# Altium schematic sheet MCU.SchDoc
size A4; Organization: Altium Limited; Address1: L3, 12a Rodborough Rd; Address2: Frenchs Forest; Address3: NSW; Address4: Australia 2086
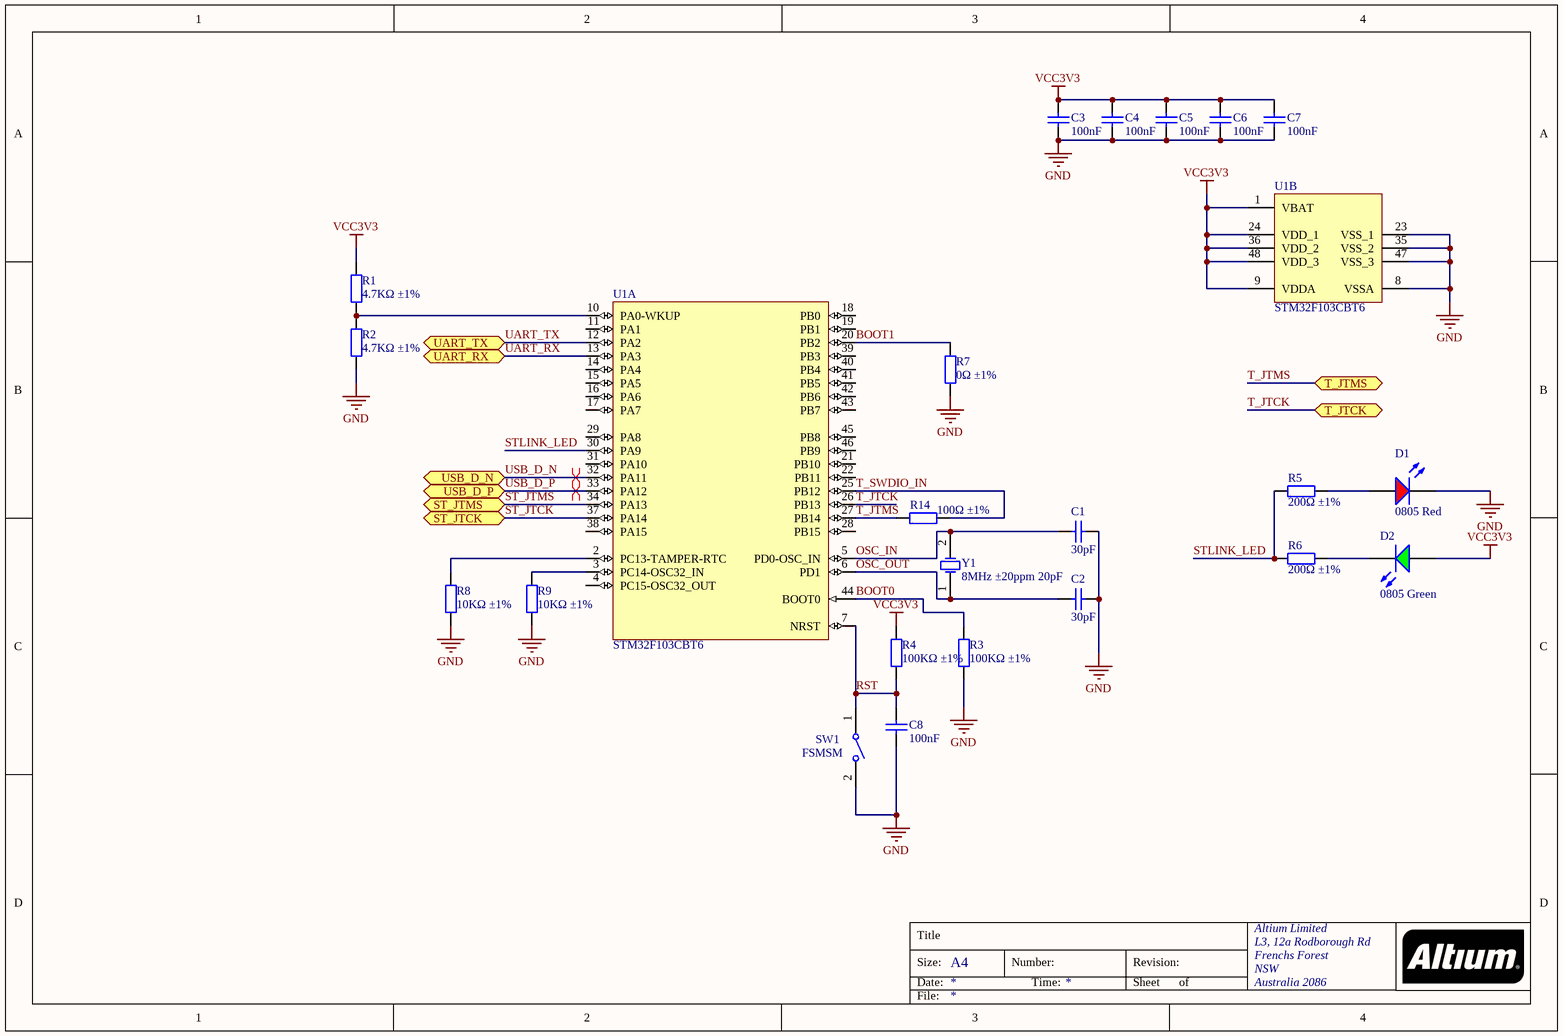
[diagram p0: MCU.SchDoc]

## Parts
C1  30pF  [0402_C]
C2  30pF  [0402_C]
C3  100nF  [0402_C]
C4  100nF  [0402_C]
C5  100nF  [0402_C]
C6  100nF  [0402_C]
C7  100nF  [0402_C]
C8  100nF  [0402_C]
D1  0805 Red  [0805_LED_S1]
D2  0805 Green  [0805_LED_S1]
R1  4.7KΩ ±1%  [0805_R]
R2  4.7KΩ ±1%  [0805_R]
R3  100KΩ ±1%  [0402_R]
R4  100KΩ ±1%  [0402_R]
R5  200Ω ±1%  [0402_R]
R6  200Ω ±1%  [0402_R]
R7  0Ω ±1%  [0402_R]
R8  10KΩ ±1%  [0402_R]
R9  10KΩ ±1%  [0402_R]
R14  100Ω ±1%  [0402_R]
SW1  FSMSM  [TECO-FSMSM-2_V]
U1  STM32F103CBT6  [LQFP-48_7x7x05P]  (parts A,B of 2)
Y1  8MHz ±20ppm 20pF  [SMD-5032_2P]

## Ports
ST_JTCK (bidir), ST_JTMS (bidir), T_JTCK (bidir), T_JTMS (bidir), UART_RX (bidir), UART_TX (bidir), USB_D_N (bidir), USB_D_P (bidir)

## Nets
GND: C1.2 C2.2 C3.1 C4.1 C5.1 C6.1 C7.1 C8.1 D1.K R2.1 R3.1 R7.1 R8.1 R9.1 SW1.2 U1.8(VSSA) U1.23(VSS_1) U1.35(VSS_2) U1.47(VSS_3)
VCC3V3: C3.2 C4.2 C5.2 C6.2 C7.2 D2.A R1.2 R4.2 U1.1(VBAT) U1.9(VDDA) U1.24(VDD_1) U1.36(VDD_2) U1.48(VDD_3)
BOOT0: R3.2 U1.44(BOOT0)
BOOT1: R7.2 U1.20(PB2)
OSC_IN: C1.1 U1.5(PD0-OSC_IN) Y1.2(OSC2)
OSC_OUT: C2.1 U1.6(PD1) Y1.1(OSC1)
RST: C8.2 R4.1 SW1.1 U1.7(NRST)
ST_JTCK: U1.37(PA14) ; port ST_JTCK
ST_JTMS: U1.34(PA13) ; port ST_JTMS
STLINK_LED: R5.1 R6.1 U1.30(PA9)
T_JTCK: U1.26(PB13) ; port T_JTCK
T_JTMS: R14.2 U1.27(PB14) ; port T_JTMS
T_SWDIO_IN: R14.1 U1.25(PB12)
UART_RX: U1.13(PA3) ; port UART_RX
UART_TX: U1.12(PA2) ; port UART_TX
USB_D_N: U1.32(PA11) ; port USB_D_N
USB_D_P: U1.33(PA12) ; port USB_D_P
NetD1_A: D1.A R5.2
NetD2_K: D2.K R6.2
NetR1_1: R1.1 R2.2 U1.10(PA0-WKUP)
NetR8_2: R8.2 U1.2(PC13-TAMPER-RTC)
NetR9_2: R9.2 U1.3(PC14-OSC32_IN)

Not connected (* = marked no-connect by the designer): U1 4(PC15-OSC32_OUT) 11(PA1) 14(PA4) 15(PA5) 16(PA6) 17(PA7) 18(PB0) 19(PB1) 21(PB10) 22(PB11) 28(PB15) 29(PA8) 31(PA10) 38(PA15) 39(PB3) 40(PB4) 41(PB5) 42(PB6) 43(PB7) 45(PB8) 46(PB9)

## Layout directives
differential pair: USB_D_N, USB_D_P

## Notes on the sheet
- Title
- Size:
- Date:
- A4
- Number:
- Time:
- Revision:
- Sheet
- of
- File:

## Library data of the parts
C1 C2 = 0402 30pF (300) 5% 50V: Chip capacitors; Manufacturer: Guangdong Fenghua Advanced Tech; PartNumber: 0402CG300J500NT; Tolerance: 5%; Voltage: 50V; ComponentLink1Description: Supplier link; ComponentLink1URL: http://www.szlcsc.com/product/details_1922.html; Package: 0402; Supplier: LC; SuppliersPartNumber: C1570; Capacitance: 30pF
C3-C8 = 0402 100nF (104) 10% 16V: Chip capacitors; Manufacturer: Samsung Electro-Mechanics; PartNumber: CL05B104KO5NNNC; Tolerance: 10%; Voltage: 16V; ComponentLink1Description: Supplier link; ComponentLink1URL: http://www.szlcsc.com/product/details_1877.html; Package: 0402; Supplier: LC; SuppliersPartNumber: C1525; Capacitance: 100nF
D1 = 0805 LED Red: LED; ComponentLink1Description: 供应商链接; ComponentLink1URL: http://www.szlcsc.com/product/details_2668.html; Package: 0805; Supplier: LC; SuppliersPartNumber: C2295; Color: Red
D2 = 0805 LED Green: LED; ComponentLink1Description: 供应商链接; ComponentLink1URL: http://www.szlcsc.com/product/details_2670.html; Package: 0805; Supplier: LC; SuppliersPartNumber: C2297; Color: Green
R1 R2 = 0805 4.7K (4701) 1%: Chip resistor; Manufacturer: Uniroyal Elec; Power: 1/8W; ComponentLink1Description: Supplier link; ComponentLink1URL: http://www.szlcsc.com/product/details_18361.html; Package: 0805; Supplier: LC; SuppliersPartNumber: C17673; Tolerance: 1%
R3 R4 = 0402 100K (1003) 1%: Chip resistor; Manufacturer: Uniroyal Elec; PartNumber: 0402WGF1003TCE; Power: 1/16W; ComponentLink1Description: Supplier link; ComponentLink1URL: http://www.szlcsc.com/product/details_26484.html; Package: 0402; Supplier: LC; SuppliersPartNumber: C25741; Resistance: 100KΩ; Tolerance: 1%
R5 R6 = 0402 200R (2000) 1%: Chip resistor; Manufacturer: Uniroyal Elec; PartNumber: 0402WGF2000TCE; Power: 1/16W; ComponentLink1Description: Supplier link; ComponentLink1URL: http://www.szlcsc.com/product/details_25830.html; Package: 0402; Supplier: LC; SuppliersPartNumber: C25087; Resistance: 200Ω; Tolerance: 1%
R7 = 0402 0R (0R0) 1%: Chip resistor; Manufacturer: Uniroyal Elec; PartNumber: 0402WGF0000TCE; Power: 1/16W; ComponentLink1Description: Supplier link; ComponentLink1URL: http://www.szlcsc.com/product/details_17853.html; Package: 0402; Supplier: LC; SuppliersPartNumber: C17168; Resistance: 0Ω; Tolerance: 1%
R8 R9 = 0402 10K (1002) 1%: Chip resistor; Manufacturer: Uniroyal Elec; PartNumber: 0402WGF1002TCE; Power: 1/16W; ComponentLink1Description: Supplier link; ComponentLink1URL: http://www.szlcsc.com/product/details_26487.html; Package: 0402; Supplier: LC; SuppliersPartNumber: C25744; Resistance: 10KΩ; Tolerance: 1%
R14 = 0402 100R (1000) 1%: Chip resistor; Manufacturer: Uniroyal Elec; PartNumber: 0402WGF1000TCE; Power: 1/16W; ComponentLink1Description: Supplier link; ComponentLink1URL: http://www.szlcsc.com/product/details_25819.html; Package: 0402; Supplier: LC; SuppliersPartNumber: C25076; Resistance: 100Ω; Tolerance: 1%
SW1 = CMP-2000-07511-1: FSMSM Push Button Switch, 50 mA, -35 to 85 degC, 2-Pin SMD, RoHS, Bulk; Manufacturer: TE Connectivity; Actuator Length: 1.07mm; Electrical Life: 20000Cycles; Actuator Material: Polyamide; Current Rating: 50mA; Illumination Type: Illuminated; Voltage Rating (DC): 24V; Contact Resistance: 100mOhm; Case\/Package: SMD/SMT; Operating Force: 180gf; Switch Travel: 0.25mm; Max Voltage Rating (DC): 12V; Throw Configuration: SPST; Packaging: LoosePiece; Max Operating Temperature: 85degC; ELV: Compliant; Package Description: 2-Pin Surface Mount Device, Body 6 x 3.5 mm, Pitch 9.19 mm; RoHSCompliant: true; Manufacturer URL: http://www.te.com/; Contact Plating: Silver; Contact Material: Brass; Mounting Technology: SurfaceMount; Contact Current Rating: 50mA; Datasheet Version: Rev. C2, 08/2014; Datasheet URL: http://www.te.com/commerce/DocumentDelivery/DDEController?Action=showdoc&DocId=Customer+Drawing%7F1437566-3%7FC2%7Fpdf%7FEnglish%7FENG_CD_1437566-3_C2_1437566_3_1_c.dwg.pdf%7F1437566-3; Mechanical Life: 20000Cycles; Package Reference: FSMSM; REACH SVHC: Unknown; Orientation: Straight; Min Operating Temperature: -35degC; Lead Free: LeadFree; Termination: GullWing; Package Quantity: 1000; Mount: SurfaceMount
U1 = STM32F103CBT6: ARM; ComponentLink1Description: 供应商链接; ComponentLink1URL: http://www.szlcsc.com/product/details_8796.html; Package: LQFP-48_7x7x05P; Supplier: LC; SuppliersPartNumber: C8304
Y1 = SMD-5032_2P 8MHz 20ppm 20pF: 贴片晶振; ComponentLink1Description: 供应商链接; ComponentLink1URL: http://www.szlcsc.com/product/details_117214.html; Package: SMD-5032_2P; Supplier: LC; SuppliersPartNumber: C115962